# Altium schematic sheet Block Diagram.SchDoc: Block Diagram
size Letter; Author: Alfredo Cortellini; Organization: IT Logic; Address1: 5753 Highway 85 N; Address2: Crestview, FL 32536; Address3: United States; DocumentNumber: 3; SheetNumber: 3; SheetTotal: 5; Email: pcb-design@itlogic.cloud
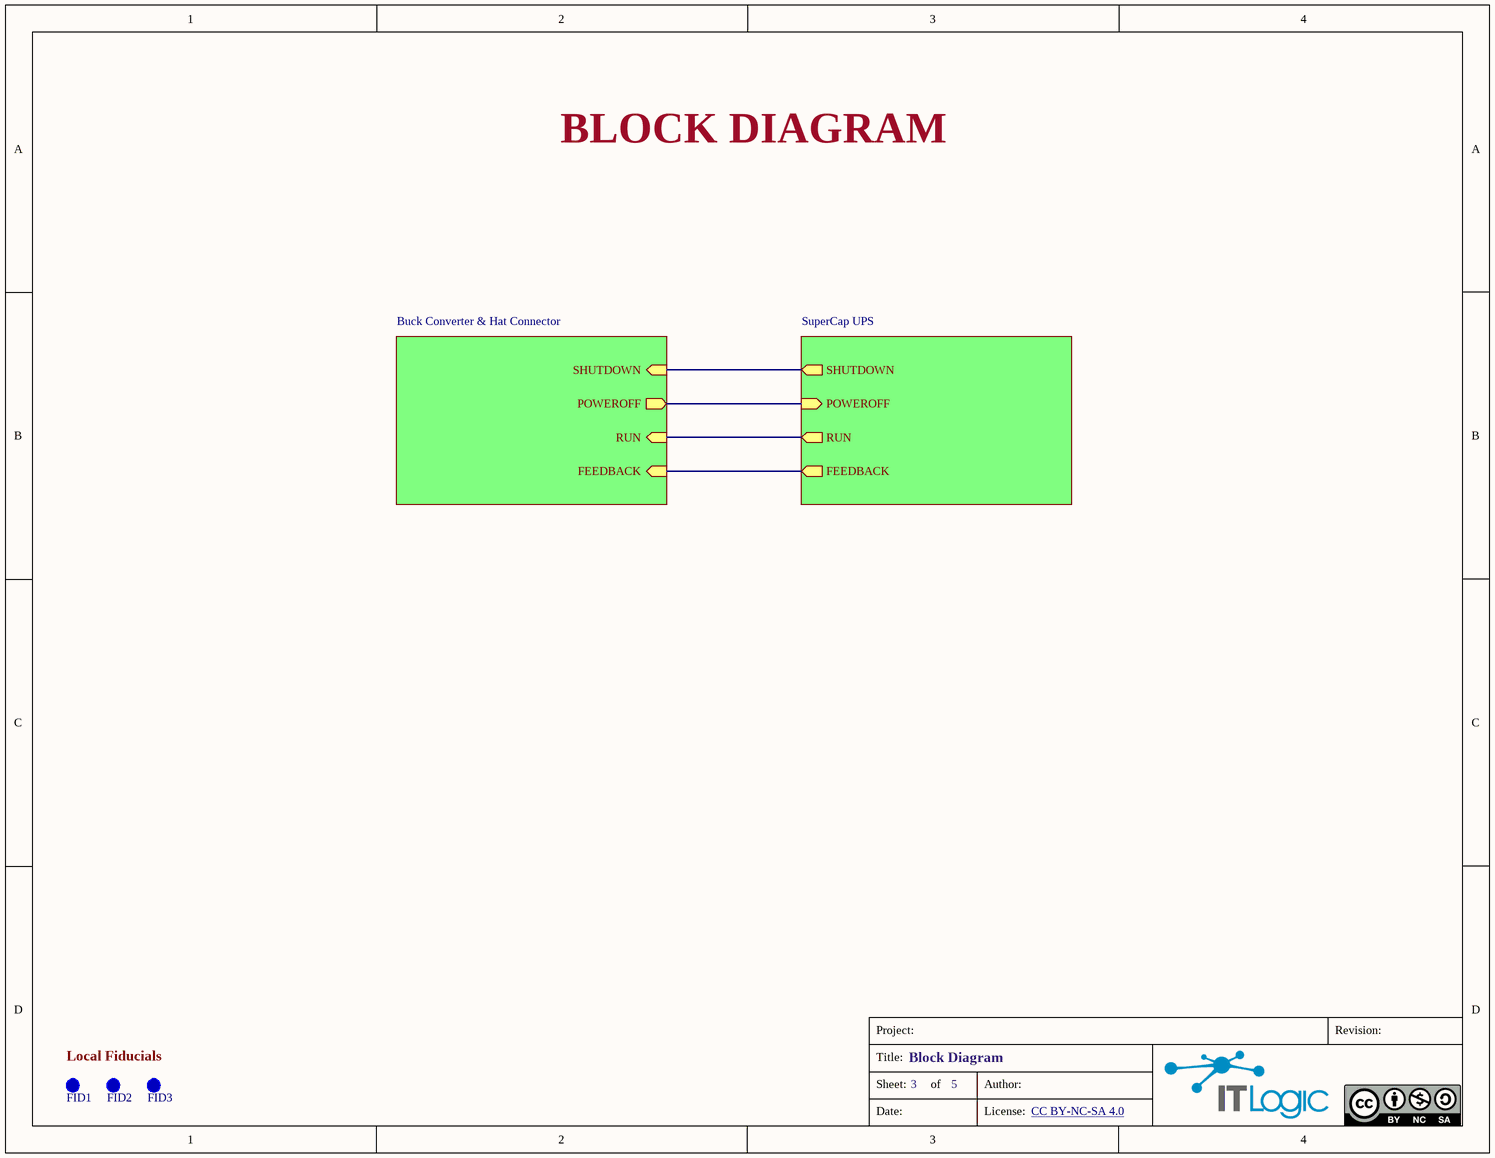
[diagram p0: Block Diagram.SchDoc]

## Parts
FID1  Local Fiducial  [FID-1-2MM]  (value not drawn)
FID2  Local Fiducial  [FID-1-2MM]  (value not drawn)
FID3  Local Fiducial  [FID-1-2MM]  (value not drawn)

## Sub-sheets
Buck Converter & Hat Connector = Buck Converter.SchDoc: POWEROFF (out), SHUTDOWN (in), RUN (in), FEEDBACK (in)
SuperCap UPS = SuperCap UPS.SchDoc: SHUTDOWN (out), POWEROFF (in), RUN (out), FEEDBACK (out)

## Nets
(unnamed): sheet Buck Converter & Hat Connector/POWEROFF, sheet SuperCap UPS/POWEROFF
(unnamed): sheet Buck Converter & Hat Connector/SHUTDOWN, sheet SuperCap UPS/SHUTDOWN
(unnamed): sheet Buck Converter & Hat Connector/RUN, sheet SuperCap UPS/RUN
(unnamed): sheet Buck Converter & Hat Connector/FEEDBACK, sheet SuperCap UPS/FEEDBACK

## Notes on the sheet
- BLOCK DIAGRAM
- Local Fiducials
- Project:
- Revision:
- Title:
- Sheet:
- of
- Author:
- Date:
- License:
- CC BY-NC-SA 4.0 <https://creativecommons.org/licenses/by-nc-sa/4.0/>

## Library data of the parts
FID1-FID3 = FID-1-2MM: Fiducial 1.0mm Diameter, 2.0mmil Mask